# Altium schematic sheet T1L_PHY.SchDoc
size 420 x 297 mm; DocumentNumber: АБВГ.123456.XXX Э3; SheetNumber: 3; SheetTotal: 4; PageSetup: Record=PageOptionsZCenterHorizontal=FalseZCenterVertical=FalseZPrintScale=0.95ZXCorrection=0.00ZYCorrection=0.00ZPrintKind=1ZBorderSize=5000000ZLeftOffset=0ZBottomOffset=0ZOrientation=1ZPaperLength=1000ZPaperWidth=1000ZScale=100ZPaperSource=15ZPrintQuality=600ZMediaType=1ZDitherType=10ZPaperKind=A4ZPrintScaleMode=1; DocumentCode: АБВГ.123456.XXX Э3
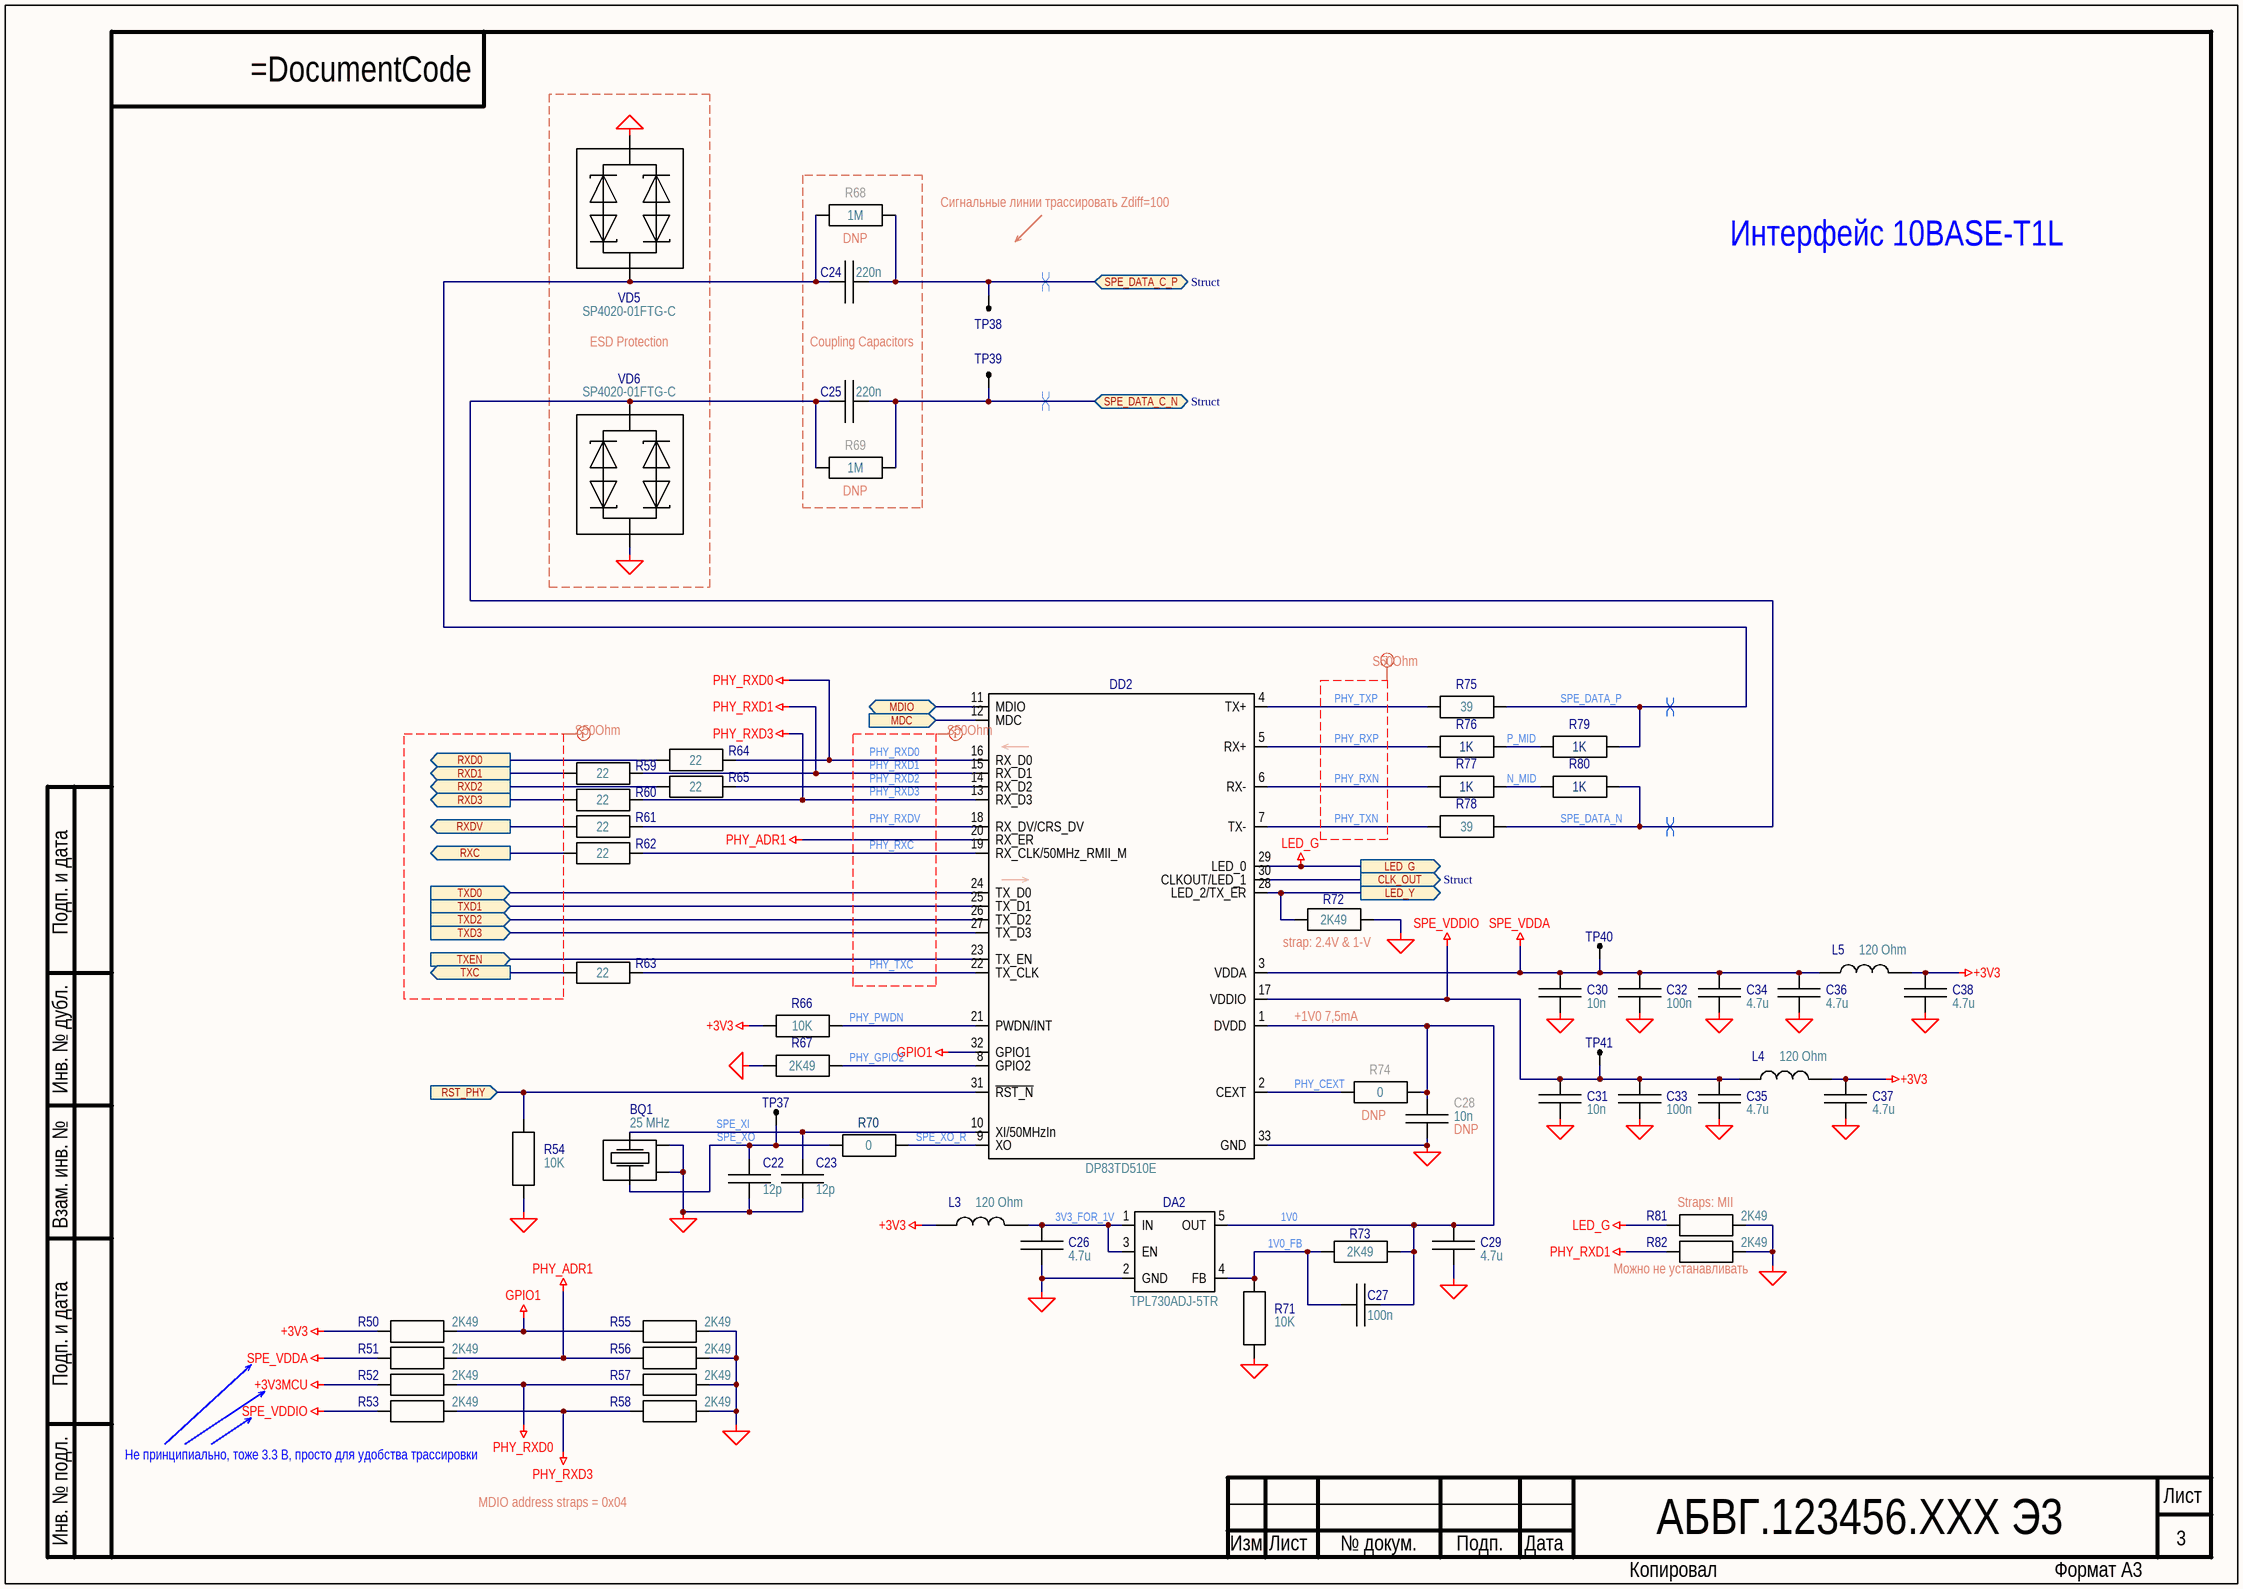
[diagram p0: T1L_PHY.SchDoc]

## Parts
BQ1  25 MHz  [DSX321G_under12MHz]
C22  12p  [C0603]
C23  12p  [C0603]
C24  220n  [C0805_rounded]
C25  220n  [C0805_rounded]
C26  4.7u  [C0603]
C27  100n  [C0402]
C28  10n  [C0402]  (no BOM)
C29  4.7u  [C0603]
C30  10n  [C0402]
C31  10n  [C0402]
C32  100n  [C0402]
C33  100n  [C0402]
C34  4.7u  [C0603]
C35  4.7u  [C0603]
C36  4.7u  [C0603]
C37  4.7u  [C0603]
C38  4.7u  [C0603]
DA2  TPL730ADJ-5TR  [SOT-23(DBV5)]
DD2  DP83TD510E  [QFN-32_ePAD_2.1x2.1]
L3  120 Ohm  [BLM18PG]
L4  120 Ohm  [BLM18PG]
L5  120 Ohm  [BLM18PG]
R50  2K49  [R0402]
R51  2K49  [R0402]
R52  2K49  [R0402]
R53  2K49  [R0402]
R54  10K  [R0402]
R55  2K49  [R0402]
R56  2K49  [R0402]
R57  2K49  [R0402]
R58  2K49  [R0402]
R59  22  [R0402]
R60  22  [R0402]
R61  22  [R0402]
R62  22  [R0402]
R63  22  [R0402]
R64  22  [R0402]
R65  22  [R0402]
R66  10K  [R0402]
R67  2K49  [R0402]
R68  1M  [R0603]  (no BOM)
R69  1M  [R0603]  (no BOM)
R70  0  [R0402]
R71  10K  [R0402]
R72  2K49  [R0402]
R73  2K49  [R0402]
R74  0  [R0402]  (no BOM)
R75  39  [R0603]
R76  1K  [R0402]
R77  1K  [R0402]
R78  39  [R0603]
R79  1K  [R0402]
R80  1K  [R0402]
R81  2K49  [R0402]
R82  2K49  [R0402]
TP37  TEST_POINT_SMD  [TEST_POINT_SMD]  (value not drawn)  (no BOM)
TP38  TEST_POINT_1.27_STEP  [TEST_POINT_1.27_STEP]  (value not drawn)  (no BOM)
TP39  TEST_POINT_1.27_STEP  [TEST_POINT_1.27_STEP]  (value not drawn)  (no BOM)
TP40  TEST_POINT_SMD  [TEST_POINT_SMD]  (value not drawn)  (no BOM)
TP41  TEST_POINT_SMD  [TEST_POINT_SMD]  (value not drawn)  (no BOM)
VD5  SP4020-01FTG-C  [SOD-323_BI]
VD6  SP4020-01FTG-C  [SOD-323_BI]

## Blocks framed on the sheet
ESD Protection: VD5 VD6

## Ports
CLK_OUT (out, see Struct), LED_G (out, see Struct), LED_Y (out, see Struct), MDC (in, see Struct, MCU), MDIO (bidir, see Struct, MCU), RST_PHY (in, see Struct, MCU), RXC (out, see Struct, MCU), RXD0 (out, see Struct, MCU), RXD1 (out, see Struct, MCU), RXD2 (out, see Struct, MCU), RXD3 (out, see Struct, MCU), RXDV (out, see Struct, MCU), SPE_DATA_C_N (bidir, see Struct), SPE_DATA_C_P (bidir, see Struct), TXC (out, see Struct, MCU), TXD0 (in, see Struct, MCU), TXD1 (in, see Struct, MCU), TXD2 (in, see Struct, MCU), TXD3 (in, see Struct, MCU), TXEN (in, see Struct, MCU)

## Nets
+3V3: C37.1 C38.1 L3.1 L4.2 L5.2 R50.1 R66.1
+3V3MCU: R52.1
GND: BQ1.2 BQ1.4 C22.2 C23.2 C26.2 C28.1 C29.2 C30.1 C31.1 C32.1 C33.1 C34.2 C35.2 C36.2 C37.2 C38.2 DA2.2(GND) DD2.33(GND) R54.1 R55.2 R56.2 R57.2 R58.2 R67.1 R71.1 R72.2 R81.2 R82.2 VD5.2 VD6.1
GPIO1: DD2.32(GPIO1) R50.2 R55.1
LED_G: DD2.29(LED_0) R81.1 ; port LED_G
PHY_ADR1: DD2.20(RX_ER) R51.2 R56.1
PHY_RXD0: DD2.16(RX_D0) R52.2 R57.1 R64.2
PHY_RXD1: DD2.15(RX_D1) R59.2 R82.1
PHY_RXD3: DD2.13(RX_D3) R53.2 R58.1 R60.2
SPE_VDDA: C30.2 C32.2 C34.1 C36.1 DD2.3(VDDA) L5.1 R51.1 TP40.1
SPE_VDDIO: C31.2 C33.2 C35.1 DD2.17(VDDIO) L4.1 R53.1 TP41.1
1V0: C27.1 C28.2 C29.1 DA2.5(OUT) DD2.1(DVDD) R73.1 R74.2
1V0_FB: C27.2 DA2.4(FB) R71.2 R73.2
3V3_FOR_1V: C26.1 DA2.1(IN) DA2.3(EN) L3.2
CLK_OUT: DD2.30(CLKOUT/LED_1) ; port CLK_OUT
LED_Y: DD2.28(LED_2/TX_ER) R72.1 ; port LED_Y
MDC: DD2.12(MDC) ; port MDC
MDIO: DD2.11(MDIO) ; port MDIO
N_MID: R77.2 R80.1
P_MID: R76.2 R79.1
PHY_CEXT: DD2.2(CEXT) R74.1
PHY_GPIO2: DD2.8(GPIO2) R67.2
PHY_PWDN: DD2.21(PWDN/INT) R66.2
PHY_RXC: DD2.19(RX_CLK/50MHz_RMII_M) R62.2
PHY_RXD2: DD2.14(RX_D2) R65.2
PHY_RXDV: DD2.18(RX_DV/CRS_DV) R61.2
PHY_RXN: DD2.6(RX-) R77.1
PHY_RXP: DD2.5(RX+) R76.1
PHY_TXC: DD2.22(TX_CLK) R63.2
PHY_TXN: DD2.7(TX-) R78.1
PHY_TXP: DD2.4(TX+) R75.1
RST_PHY: DD2.31(~{RST_N}) R54.2 ; port RST_PHY
RXC: R62.1 ; port RXC
RXD0: R64.1 ; port RXD0
RXD1: R59.1 ; port RXD1
RXD2: R65.1 ; port RXD2
RXD3: R60.1 ; port RXD3
RXDV: R61.1 ; port RXDV
SPE_DATA_C_N: C25.2 R69.2 TP39.1 ; port SPE_DATA_C_N
SPE_DATA_C_P: C24.2 R68.2 TP38.1 ; port SPE_DATA_C_P
SPE_DATA_N: C25.1 R69.1 R78.2 R80.2 VD6.2
SPE_DATA_P: C24.1 R68.1 R75.2 R79.2 VD5.1
SPE_XI: BQ1.3 C23.1 DD2.10(XI/50MHzIn)
SPE_XO: BQ1.1 C22.1 R70.1 TP37.1
SPE_XO_R: DD2.9(XO) R70.2
TXC: R63.1 ; port TXC
TXD0: DD2.24(TX_D0) ; port TXD0
TXD1: DD2.25(TX_D1) ; port TXD1
TXD2: DD2.26(TX_D2) ; port TXD2
TXD3: DD2.27(TX_D3) ; port TXD3
TXEN: DD2.23(TX_EN) ; port TXEN

## Layout directives
net class S50Ohm: (no net found under the mark), PHY_RXC, PHY_RXD0, PHY_RXD1, PHY_RXD2, PHY_RXD3, PHY_RXDV, PHY_RXN, PHY_RXP, PHY_TXC, PHY_TXN, PHY_TXP
differential pair: SPE_DATA_C_N, SPE_DATA_C_P, SPE_DATA_N, SPE_DATA_P

## Notes on the sheet
- (near R68) DNP
- (near R68) Сигнальные линии трассировать Zdiff=100
- Интерфейс 10BASE-T1L
- Coupling Capacitors
- (near R69) DNP
- strap: 2.4V & 1-V
- (near DD2) +1V0 7,5mA
- (near R74) DNP
- (near C28) DNP
- (near R81) Straps: MII
- (near R82) Можно не устанавливать
- (near R53) Не принципиально, тоже 3.3 В, просто для удобства трассировки
- MDIO address straps = 0x04
- Labels drawn without touching a wire or pin: =DocumentCode
- Подп. и дата
- Инв. № дубл.
- Взам. инв. №
- Инв. № подл.
- Лист
- Изм.
- № докум.
- Подп.
- Дата
- Копировал
- Формат А3

## Library data of the parts
BQ1 = YSX321SL: Резонатор кварцевый X322525MOB4SI 25 MHz; Manufacturer: YXC; Manufacturer Part Number: X322525MOB4SI; Component Type: Резонатор кварцевый
C22 C23 = C0603: Чип-конденсатор 12 пФ 5% 50 В C0G(NP0) 0603; Manufacturer Part Number: CC0603JRNPO9BN120; Manufacturer: Yageo; TYPE: Чип-конденсатор 0603; Value: 12 пФ 5% 50 В C0G(NP0); Component Type: Конденсатор
C24 C25 = C0805_2: Чип-конденсатор 0,22 мкФ ±10% 100 В X7R 0805; Manufacturer Part Number: CC0805KKX7R0BB224; Manufacturer: Yageo; TYPE: Чип-конденсатор 0805; Value: 0,22 мкФ ±10% 100 В X7R; Component Type: Конденсатор
C26 C29 C34-C38 = C0603: Чип-конденсатор 4,7 мкФ 10% 16 В X5R 0603; Manufacturer Part Number: CC0603KRX5R7BB475; Manufacturer: Yageo; TYPE: Чип-конденсатор 0603; Value: 4,7 мкФ 10% 16 В X5R; Component Type: Конденсатор
C27 C32 C33 = C0402: Чип-конденсатор 100 нФ 10% 50 В X7R 0402; Manufacturer Part Number: CC0402KRX7R9BB104; Manufacturer: Yageo; Value: 100 нФ 10% 50 В X7R; Component Type: Конденсатор
C28 C30 C31 = C0402: Чип-конденсатор 10 нФ 10% 50 В X7R 0402; Manufacturer Part Number: CC0402KRX7R9BB103; Manufacturer: Yageo; Value: 10 нФ 10% 50 В X7R; Component Type: Конденсатор
DA2 = TPL730ADJ-5TR: LDO-регулятор SOT-23-5; Manufacturer: 3PEAK; Manufacturer Part Number: TPL730ADJ-5TR; Component Type: Микросхема
DD2 = DP83TD510E: Микросхема приёмопередатчика 10Base-T1L; Manufacturer: Texas Instruments; Manufacturer Part Number: DP83TD510ERHB; Component Type: Микросхема
L3-L5 = BLM18PG121SN1D: Фильтр индуктивный 120 Ом @ 100 МГц 2 А 0603; Manufacturer: FENGHUA Advanced Technology; Manufacturer Part Number: CBM160808U121T; VALUE: 120 Ом @ 100 МГц 2 А; Component Type: Фильтр индуктивный
R50-R53 R55-R58 R81 R82 = R0402_tooth_4: Чип-резистор 2,49 кОм 1% 0402; Manufacturer Part Number: RC0402FR-072K49L; Manufacturer: Yageo; Value: 2,49 кОм 1%; Component Type: Резистор
R54 R66 R71 = R0402: Чип-резистор 10 кОм 1% 0402; Manufacturer Part Number: RC0402FR-0710KL; Manufacturer: Yageo; Value: 10 кОм 1%; Component Type: Резистор
R59-R65 = R0402_tooth_1: Чип-резистор 22 Ом 1% 0402; Manufacturer Part Number: RC0402FR-0722RL; Manufacturer: Yageo; Value: 22 Ом 1%; Component Type: Резистор
R67 R72 R73 = R0402: Чип-резистор 2,49 кОм 1% 0402; Manufacturer Part Number: RC0402FR-072K49L; Manufacturer: Yageo; Value: 2,49 кОм 1%; Component Type: Резистор
R68 R69 = R0603_13: Чип-резистор 1 МОм 1% 0603; Manufacturer Part Number: RC0603FR-071ML; Manufacturer: Yageo; Value: 1 МОм 1%; TYPE: Чип-резистор 0603; Component Type: Резистор
R70 R74 = R0402: Чип-резистор 0 ом 1% 0402; Manufacturer Part Number: RC0402FR-070RL; Manufacturer: Yageo; Value: 0 ом 1%; Component Type: Резистор
R75 R78 = R0603: Чип-резистор 39 Ом 1% 0603; Manufacturer Part Number: RC0603FR-0739RL; Manufacturer: Yageo; Value: 39 Ом 1%; TYPE: Чип-резистор 0603; Component Type: Резистор
R76 R77 R79 R80 = R0402_4: Чип-резистор 1 кОм 1% 0402; Manufacturer Part Number: RC0402FR-071KL; Manufacturer: Yageo; Value: 1 кОм 1%; Component Type: Резистор
TP37 TP40 TP41 = TEST_POINT_SMD: Контрольная точка SMD
TP38 TP39 = TEST_POINT_1.27_STEP: Контрольная точка SMD
VD5 VD6 = SP4020-01FTG-C: TVS-диод симметричный +3V3; Manufacturer: TECH PUBLIC Co.; Manufacturer Part Number: SP4020-01FTG-C; Component Type: Сборка диодная